# EAGLE design MPL115A2-v12 (EAGLE 6.2)
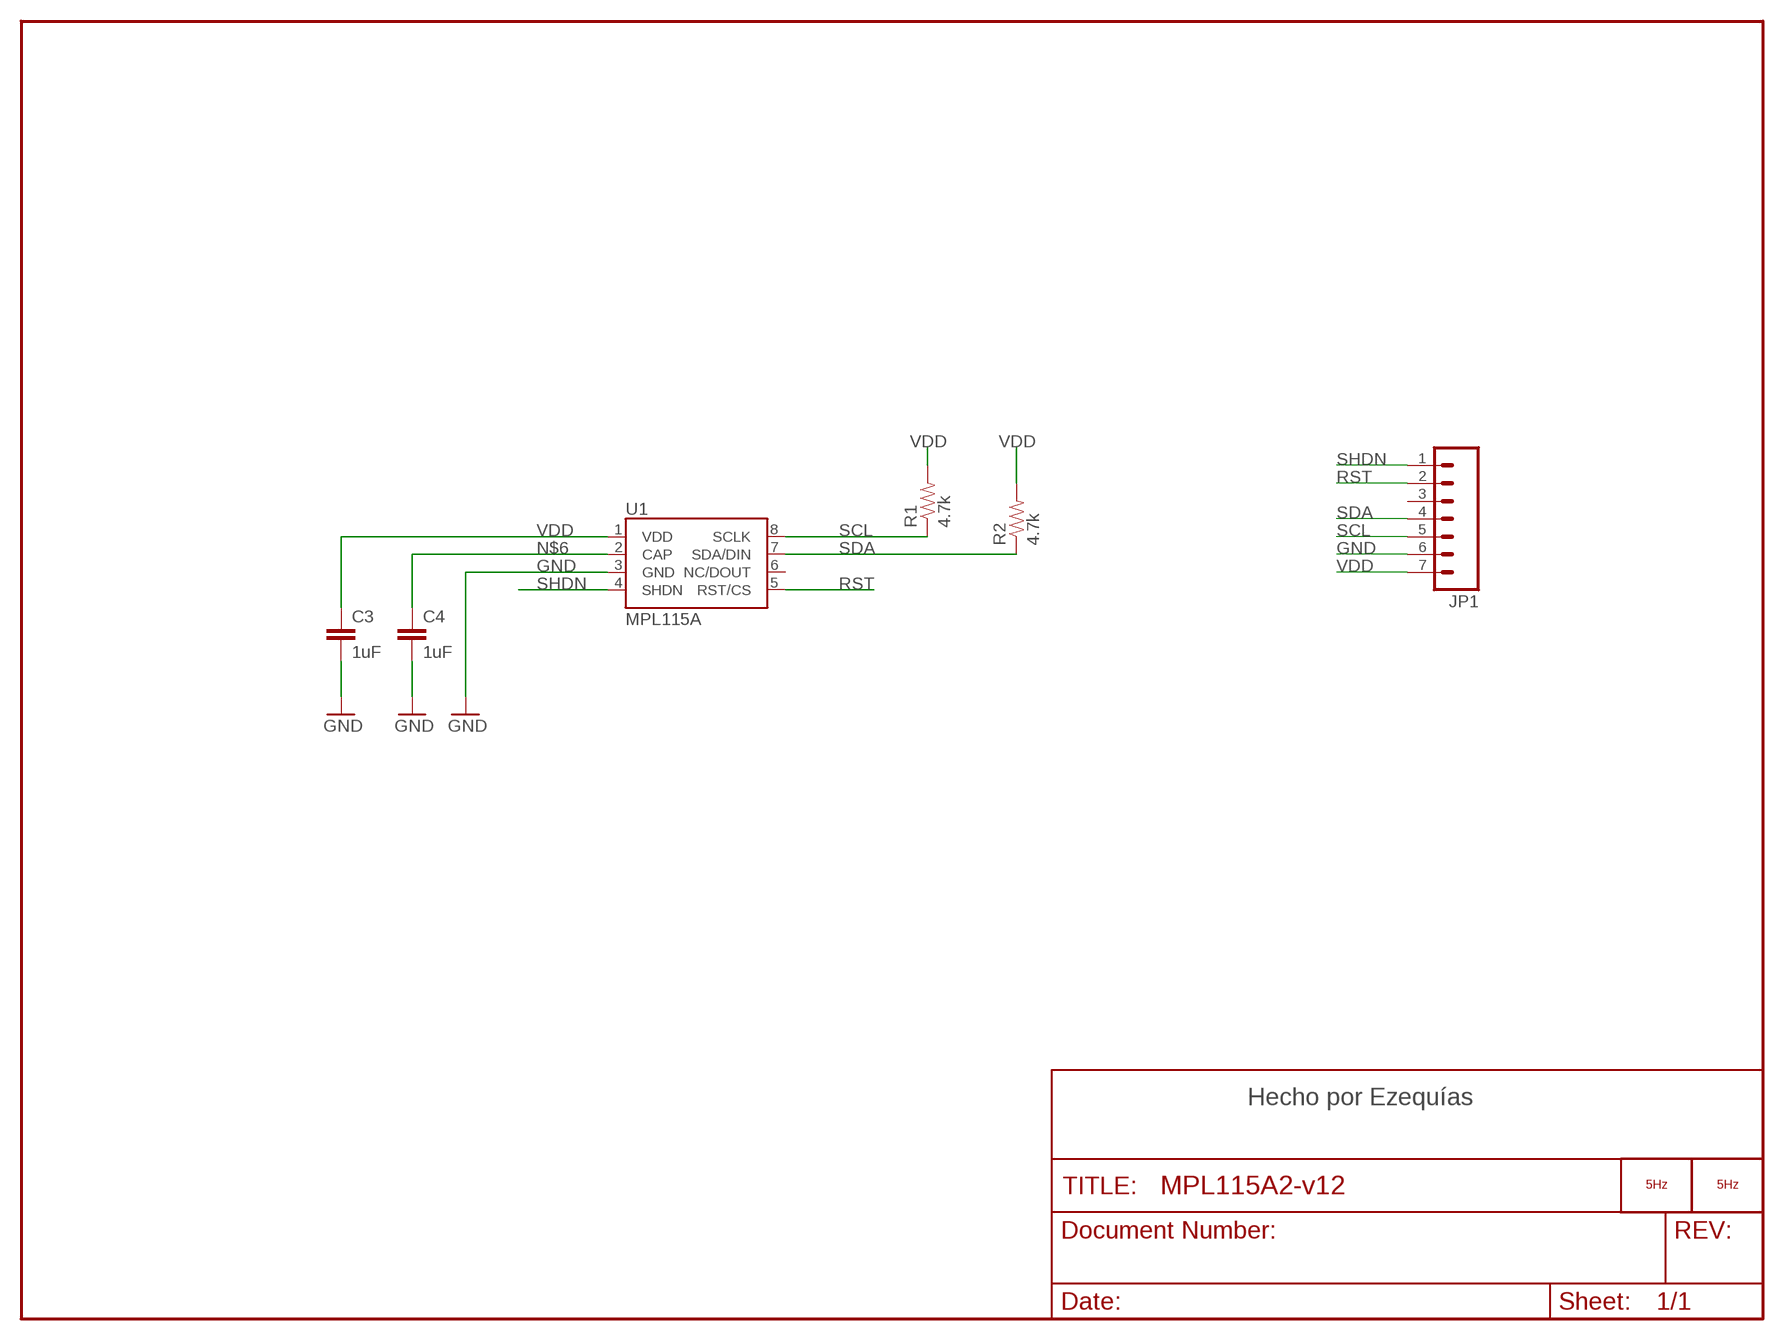
[diagram p0: schematic, sheet 1]

## Parts
C3  1uF  CAP0805-CAP  [0805-CAP]
C4  1uF  CAP0805-CAP  [0805-CAP]
JP1  M07  [1X07]
LOGO1  LOGO_5HZ_H_5MM  [5HZ_LOGO_H_5MM]
LOGO2  LOGO_5HZ_MINUSCULAS  LOGO_5HZ_H_5MM  [5HZ_LOGO_H_5MM]
R1  4.7k  RESISTORPTH-1/6W  [1/6W-RES]
R2  4.7k  RESISTORPTH-1/6W  [1/6W-RES]
U1  MPL115A  [LGA8]

## Nets
GND: C3.2 C4.2 JP1.6 U1.3(GND)
N$6: C4.1 U1.2(CAP)
RST: JP1.2 U1.5(RST/CS)
SCL: JP1.5 R1.1 U1.8(SCLK)
SDA: JP1.4 R2.1 U1.7(SDA/DIN)
SHDN: JP1.1 U1.4(SHDN)
VDD: C3.1 JP1.7 R1.2 R2.2 U1.1(VDD)
Unconnected: JP1.3 U1.6(NC/DOUT)

## Notes on the sheet
- Hecho por Ezequías

## Library data of the parts
C3 C4 = 5hz-electronica:CAP: Capacitor Standard 0603 ceramic capacitor, and 0.1" leaded capacitor.
JP1 = SparkFun:M07: Header 7 Standard 7-pin 0.1" header. Use with straight break away headers (SKU : PRT-00116), right angle break away headers (PRT-00553), swiss pins (PRT-00743), machine pins (PRT-00117), and female headers (PRT-00115). NOTES ON THE VARIANTS LOCK and LOCK_LONGPADS... This footprint was designed to help hold the alignment of a through-hole component (i.e. 7-pin header) while soldering it into place. You may notice that each hole has been shifted either up or down by 0.005 of an inch from it's more standard position (which is usually a perfectly straight line). This slight alteration caused the pins (the squares in the middle) to touch the edges of the holes. Because they are alternating, it causes a "brace" to hold the header in place. 0.005 has proven to be the perfect amount of "off-center" position when using our standard breakaway headers. Although looks a little odd when you look at the bare footprint, once you have a header in there, the alteration is very hard to notice. Also, if you push a header all the way into place, it is covered up entirely on the bottom side. This idea of altering the position of holes to aid alignment will be further integrated into the Sparkfun Library for other footprints. It can help hold any component with 3 or more connection pins.
LOGO1 LOGO2 = 5hz-electronica:LOGO_5HZ: Logotipo 5Hz "según Pedro"
R1 R2 = SparkFun:RESISTOR: Resistor Basic schematic elements and footprints for 0603, 1206, and PTH resistors.
U1 = SparkFun:MPL115A: MPL115A1 (SPI) and MPL115A2 (I2C) Miniature Digital Barometer 5.0x3.0x1.2mm LGA Package

## Board
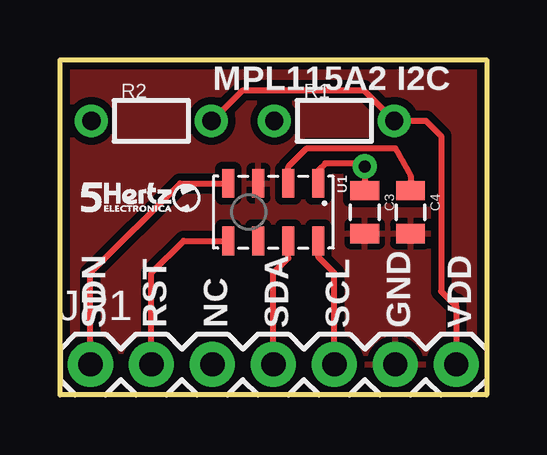
[diagram p1: board, top side]
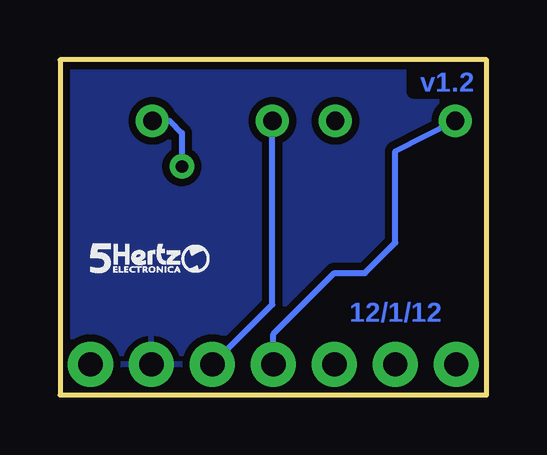
[diagram p2: board, bottom side, seen from below]

Size 17.78 x 13.97 mm. Coordinates in mm from the lower left corner, seen from the top.
Outline: 0,13.97 17.78,13.97 17.78,0 0,0 0,13.97
Copper layers (1*16): Top 0.035mm / dielectric 1.5mm / Bottom 0.035mm
Design rules: minimum track width 8mil, minimum drill 20mil, track to track 8mil, track to pad 8mil, pad to pad 8mil, via to via 8mil, smd to smd 8mil, copper to edge 9mil, drill to drill 8mil, minimum pad ring 12mil, minimum via ring 10mil, stop-mask expansion 4mil, vias tented up to drill 20mil, thermal gap 10mil

### Footprints (pad centres in the part's own frame; a part is rotated, then mirrored left to right if it is on the bottom)
0805-CAP = smd 0.8 x 1.2: 1 -0.9,0; 2 0.9,0
1X07 = drill 1.016 pad 1.88: 1 0,0; 2 2.54,0; 3 5.08,0; 4 7.62,0; 5 10.16,0; 6 12.7,0; 7 15.24,0
1/6W-RES = drill 0.762: 1 -2.5,0; 2 2.5,0
LGA8 = smd 1.2 x 0.5: 1 -1.2,1.875; 2 -1.2,0.625; 3 -1.2,-0.625; 4 -1.2,-1.875; 5 1.2,-1.875; 6 1.2,-0.625; 7 1.2,0.625; 8 1.2,1.875

### Placement (x,y rotation side)
C3  12.7,7.62 270 top
C4  14.61,7.62 270 top
JP1  1.27,1.27 0 top
LOGO1  0.89,7.62 0 top
LOGO2  16.51,5.08 0 bottom
R1  11.43,11.43 0 top
R2  3.81,11.43 0 top
U1  8.89,7.62 270 top

### Tracks (layer width: path | path; a pad name or v marks a point on that pad's centre or on a via)
GND
  pour Bottom (isolate 0.305): 0,0 0,13.97 17.78,13.97 17.78,0
  pour Top (isolate 0.305): 0,0 0,13.97 17.78,13.97 17.78,0
N$6
  Top 0.254: U1.2 9.52,9.52 10.29,10.29 13.97,10.29 14.61,9.14 C4.1
RST
  Top 0.254: JP1.2 3.81,5.08 5.15,6.42 U1.5
SCL
  Top 0.254: U1.8 10.77,5.75 11.43,5.08 JP1.5
  Bottom 0.254: R1.1 8.93,3.77 JP1.5
SDA
  Top 0.254: JP1.4 8.89,5.08 9.52,5.71 U1.7
  Bottom 0.254: JP1.4 8.89,2.54 6.35,5.08 5.08,5.08 3.81,6.35 3.81,10.16 R2.1
SHDN
  Top 0.254: JP1.1 1.27,5.08 5.01,8.82 U1.4
VDD  (via drill 0.51)
  Top 0.254: 16.51,3.68 JP1.7 | 16.51,3.68 16.51,3.81 | 16.51,3.68 15.88,4.32 15.88,10.79 15.24,11.43 R1.2 12.66,12.7 7.62,12.7 6.35,11.43 R2.2 | C3.1 12.72,8.77 12.72,8.87 12.7,8.89 v12.7,9.53 12.57,9.65 11.05,9.65 10.77,9.37 10.77,9.17 U1.1
  Bottom 0.254: v12.7,9.53 12.7,10.92 13.21,11.43 R1.2

### Text on the board
Bottom: v1.2 | 12/1/12
tPlace: MPL115A2 I2C | SDN | RST | NC | SDA | SCL | GND | VDD